# EAGLE design MIDI Output (EAGLE 9.0.1)
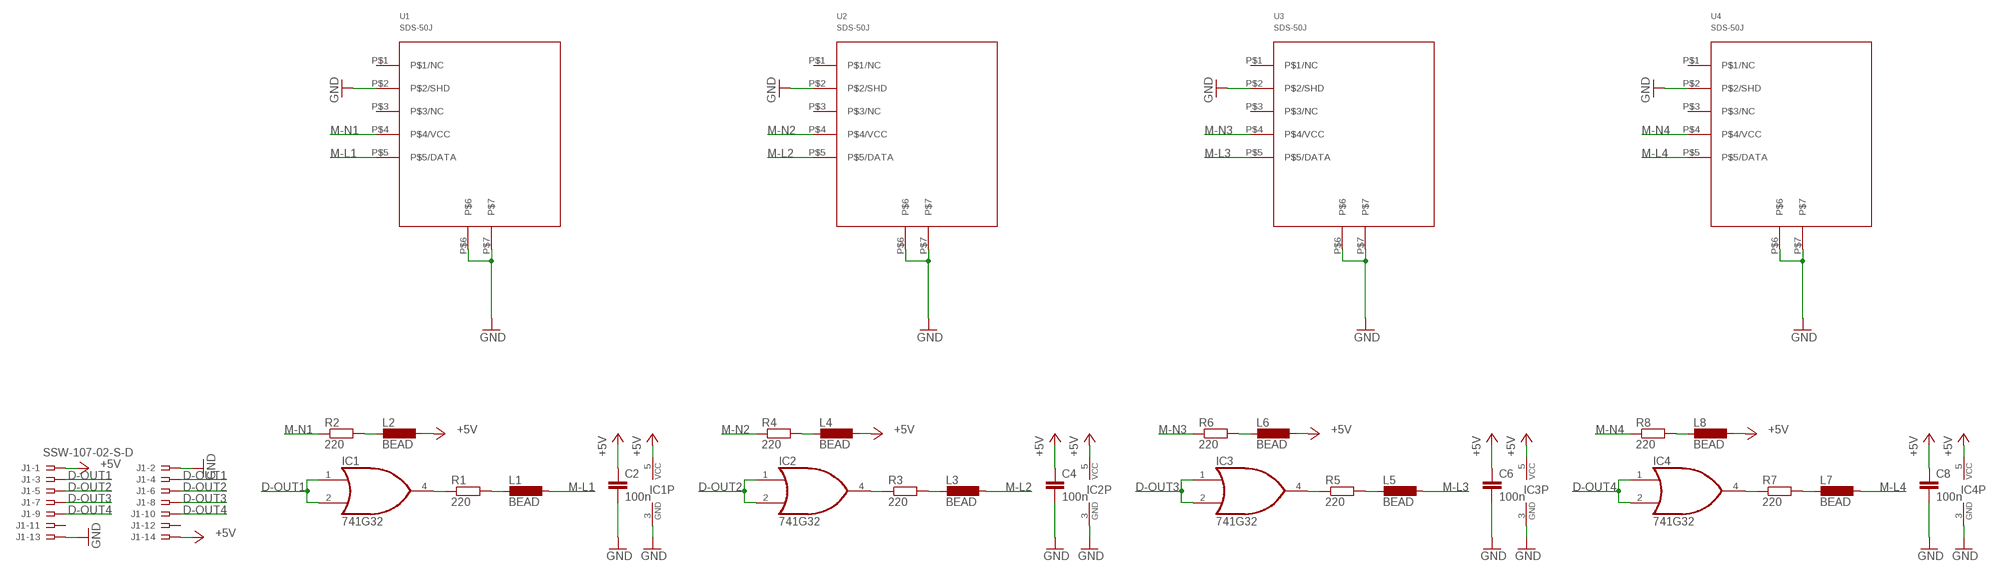
[diagram p0: schematic, sheet 1]

## Parts
C2  100n  C-EUC0805  [C0805]
C4  100n  C-EUC0805  [C0805]
C6  100n  C-EUC0805  [C0805]
C8  100n  C-EUC0805  [C0805]
IC1  741G32  [SOT25]
IC2  741G32  [SOT25]
IC3  741G32  [SOT25]
IC4  741G32  [SOT25]
J1  SSW-107-02-S-D  [SSW-107-02-S-D]
L1  BEAD  [L0805]
L2  BEAD  [L0805]
L3  BEAD  [L0805]
L4  BEAD  [L0805]
L5  BEAD  [L0805]
L6  BEAD  [L0805]
L7  BEAD  [L0805]
L8  BEAD  [L0805]
R1  220  R-EU_R0805  [R0805]
R2  220  R-EU_R0805  [R0805]
R3  220  R-EU_R0805  [R0805]
R4  220  R-EU_R0805  [R0805]
R5  220  R-EU_R0805  [R0805]
R6  220  R-EU_R0805  [R0805]
R7  220  R-EU_R0805  [R0805]
R8  220  R-EU_R0805  [R0805]
U1  SDS-50J  [SDS-50J]
U2  SDS-50J  [SDS-50J]
U3  SDS-50J  [SDS-50J]
U4  SDS-50J  [SDS-50J]

## Nets
+5V: C2.1 C4.1 C6.1 C8.1 IC1.5(VCC) IC2.5(VCC) IC3.5(VCC) IC4.5(VCC) J1.1 J1.14 L2.2 L4.2 L6.2 L8.2
D-OUT1: IC1.1(I0) IC1.2(I1) J1.3 J1.4
D-OUT2: IC2.1(I0) IC2.2(I1) J1.5 J1.6
D-OUT3: IC3.1(I0) IC3.2(I1) J1.7 J1.8
D-OUT4: IC4.1(I0) IC4.2(I1) J1.9 J1.10
GND: C2.2 C4.2 C6.2 C8.2 IC1.3(GND) IC2.3(GND) IC3.3(GND) IC4.3(GND) J1.2 J1.13 U1.P$2(P$2/SHD) U1.P$6 U1.P$7 U2.P$2(P$2/SHD) U2.P$6 U2.P$7 U3.P$2(P$2/SHD) U3.P$6 U3.P$7 U4.P$2(P$2/SHD) U4.P$6 U4.P$7
M-L1: L1.2 U1.P$5(P$5/DATA)
M-L2: L3.2 U2.P$5(P$5/DATA)
M-L3: L5.2 U3.P$5(P$5/DATA)
M-L4: L7.2 U4.P$5(P$5/DATA)
M-N1: R2.1 U1.P$4(P$4/VCC)
M-N2: R4.1 U2.P$4(P$4/VCC)
M-N3: R6.1 U3.P$4(P$4/VCC)
M-N4: R8.1 U4.P$4(P$4/VCC)
N$4: IC1.4(O) R1.1
N$8: L2.1 R2.2
N$9: L1.1 R1.2
N$12: L3.1 R3.2
N$14: L4.1 R4.2
N$16: IC2.4(O) R3.1
N$20: L5.1 R5.2
N$22: L6.1 R6.2
N$24: IC3.4(O) R5.1
N$28: L7.1 R7.2
N$30: L8.1 R8.2
N$32: IC4.4(O) R7.1
Unconnected: J1.11 J1.12 U1.P$1(P$1/NC) U1.P$3(P$3/NC) U2.P$1(P$1/NC) U2.P$3(P$3/NC) U3.P$1(P$1/NC) U3.P$3(P$3/NC) U4.P$1(P$1/NC) U4.P$3(P$3/NC)

## Library data of the parts
C2 C4 C6 C8 = rcl:C-EU: CAPACITOR, European symbol
IC1-IC4 = MIDI router parts:74*1G32: 2-input OR gate; SPICEPREFIX: J
J1 = con-samtec:SSW-107-02-S-D: THROUGH-HOLE .025" SQ POST SOCKET Source: Samtec SSW.pdf; MPN: SSW-107-02-S-D; OC_FARNELL: unknown; OC_NEWARK: 11P9431
L1-L8 = MIDI router parts:BEAD
R1-R8 = rcl:R-EU_: RESISTOR, European symbol
U1-U4 = MIDI router parts:SDS-50J

## Board
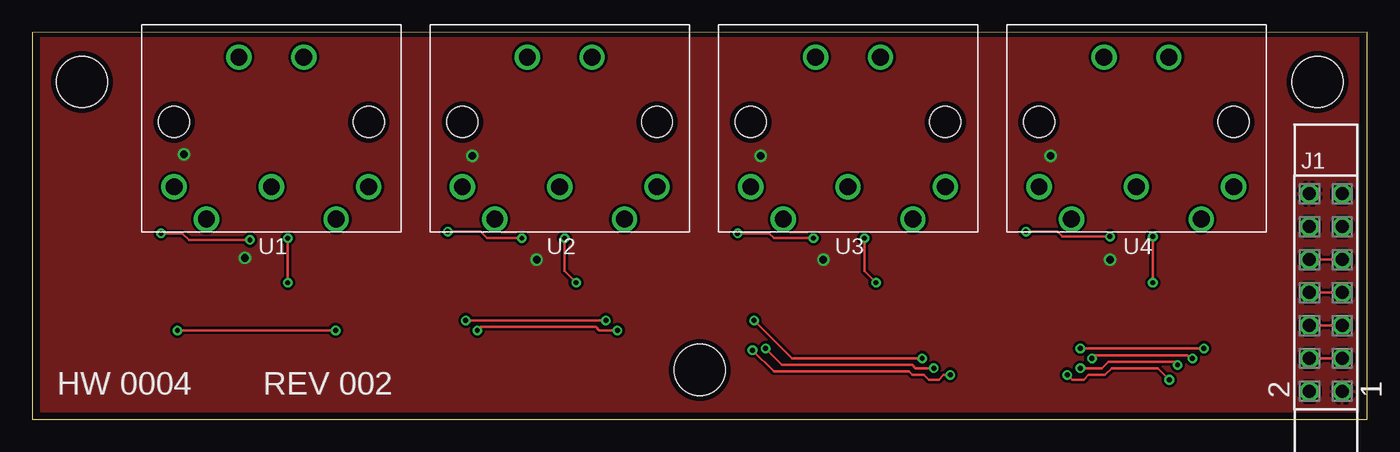
[diagram p1: board, top side]
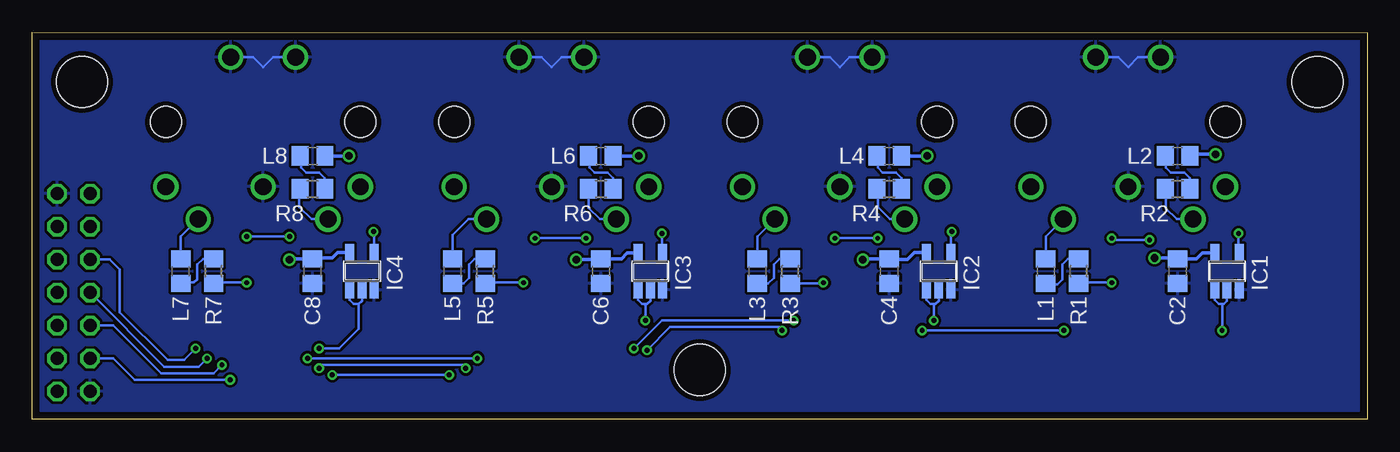
[diagram p2: board, bottom side, seen from below]

Size 102.87 x 29.84 mm. Coordinates in mm from the lower left corner, seen from the top.
Outline: 0,0 102.87,0 102.87,29.84 0,29.84 0,0
Copper layers (1*16): Top 0.0356mm / dielectric 1.5011mm / Bottom 0.0356mm
Design rules "LaenPCBOrder *": minimum track width 6mil, minimum drill 13mil, track to track 8mil, track to pad 8mil, pad to pad 8mil, via to via 8mil, smd to smd 8mil, copper to edge 15mil, drill to drill 6mil, minimum pad ring 7mil, minimum via ring 7mil, stop-mask expansion 3mil, vias tented up to drill 0mil, thermal gap 10mil
Holes 3.96 mm at 3.81,26.04 99.06,26.04 51.44,3.81

### Footprints (pad centres in the part's own frame; a part is rotated, then mirrored left to right if it is on the bottom)
C0805 = smd 1.3 x 1.5: 1 -0.95,0; 2 0.95,0
SOT25 = smd 0.69 x 1.29: 1 -0.95,-1.44; 2 0,-1.44; 3 0.95,-1.44; 4 0.95,1.44; 5 -0.95,1.44
SSW-107-02-G-D = drill 1 pad 1.5 octagon: 1 -7.62,-1.27; 2 -7.62,1.27; 3 -5.08,-1.27; 4 -5.08,1.27; 5 -2.54,-1.27; 6 -2.54,1.27; 7 0,-1.27; 8 0,1.27; 9 2.54,-1.27; 10 2.54,1.27; 11 5.08,-1.27; 12 5.08,1.27; 13 7.62,-1.27; 14 7.62,1.27
L0805 = smd 1.3 x 1.5: 1 -0.95,0; 2 0.95,0
R0805 = smd 1.3 x 1.5: 1 -0.95,0; 2 0.95,0
SDS-50J = drill 1.3: P$1 7.5,10; P$2 0,10; P$3 -7.5,10; P$4 5,12.5; P$5 -5,12.5; P$6 2.5,0; P$7 -2.5,0 | hole 2.4: -7.5,5; 7.5,5

### Placement (x,y rotation side)
C2  14.61,11.43 270 bottom
C4  36.83,11.43 270 bottom
C6  59.05,11.43 270 bottom
C8  81.28,11.43 270 bottom
IC1  10.79,11.43 0 bottom
IC2  33.02,11.43 0 bottom
IC3  55.24,11.43 0 bottom
IC4  77.47,11.43 0 bottom
J1  SSW-107-02-G-D  [SSW-107-02-G-D]  99.69,9.78 90 top
L1  24.77,11.43 90 bottom
L2  14.61,20.32 0 bottom
L3  46.99,11.43 90 bottom
L4  36.83,20.32 0 bottom
L5  70.48,11.43 90 bottom
L6  59.05,20.32 0 bottom
L7  91.44,11.43 90 bottom
L8  81.28,20.32 0 bottom
R1  22.23,11.43 90 bottom
R2  14.61,17.78 0 bottom
R3  44.45,11.43 90 bottom
R4  36.83,17.78 0 bottom
R5  67.94,11.43 90 bottom
R6  59.05,17.78 0 bottom
R7  88.9,11.43 90 bottom
R8  81.28,17.78 0 bottom
U1  18.41,27.94 180 top
U2  40.64,27.94 180 top
U3  62.87,27.94 180 top
U4  85.09,27.94 180 top

### Tracks (layer width: path | path; a pad name or v marks a point on that pad's centre or on a via)
+5V  (via drill 0.58)
  Bottom 0.254: IC1.5 11.79,12.83 12.7,12.83 13.15,12.38 C2.1 14.67,12.45 v16.38,12.45 | L2.2 13.53,20.45 v11.68,20.45 | L4.2 v33.91,20.32 | IC2.5 34.88,12.87 35.43,12.32 36.77,12.32 C4.1 38.8,12.38 v38.86,12.32 | L6.2 v56.13,20.32 | IC3.5 56.24,12.83 57.02,12.83 57.47,12.38 C6.1 59.12,12.32 v60.96,12.32 | L8.2 v78.49,20.32 | IC4.5 79.33,12.87 79.76,12.45 81.21,12.45 C8.1 83,12.38 v83.06,12.32
  pour Top: 0.64,29.84 0.64,0.64 102.23,0.64 102.23,29.84
D-OUT1  (via drill 0.38)
  Top 0.191: J1.4 J1.3 | v87.63,3.05 86.74,3.94 83.19,3.94 82.68,3.43 81.41,3.43 81.03,3.05 80.14,3.05 v79.76,3.43 | v70.74,3.43 70.23,3.43 69.85,3.05 69.09,3.05 68.71,3.43 67.82,3.43 67.56,3.68 57.15,3.68 v55.5,5.33 | v45.09,6.86 43.69,6.86 43.43,7.11 34.54,7.11 v34.29,6.86 | v23.37,6.86 v11.18,6.86
  Bottom 0.191: IC1.2 10.79,9.14 11.05,8.89 11.18,8.89 | 11.18,8.89 11.43,8.89 11.74,9.21 IC1.1 | v79.76,3.43 v70.74,3.43 | v55.5,5.33 53.72,7.11 45.34,7.11 v45.09,6.86 | v34.29,6.86 v23.37,6.86 | v11.18,6.86 11.18,8.89 | J1.4 96.65,4.7 95,3.05 v87.63,3.05
D-OUT2  (via drill 0.38)
  Top 0.191: J1.6 J1.5 | v88.27,4.19 88.01,4.45 82.93,4.45 82.42,3.94 v80.77,3.94 | v69.47,3.94 68.07,3.94 67.82,4.19 57.78,4.19 v56.52,5.46 | v44.2,7.62 v33.4,7.62
  Bottom 0.191: IC2.2 33.02,9.14 33.27,8.89 33.4,8.89 | 33.4,8.89 33.66,8.89 33.97,9.21 IC2.1 | v88.27,4.19 88.9,3.56 92.96,3.56 96.65,7.24 J1.6 | v80.77,3.94 80.52,4.19 69.72,4.19 v69.47,3.94 | v56.52,5.46 54.36,7.62 v44.2,7.62 | v33.4,7.62 33.4,8.89
D-OUT3  (via drill 0.38)
  Top 0.191: J1.8 J1.7 | v89.41,4.7 89.28,4.7 89.03,4.95 81.92,4.95 v81.66,4.7 | v68.58,4.7 58.55,4.7 v55.63,7.62
  Bottom 0.191: IC3.2 55.24,9.14 55.5,8.89 55.75,8.89 | 55.75,8.89 55.88,8.89 56.2,9.21 IC3.1 | v89.41,4.7 90.04,4.06 92.71,4.06 J1.8 | v81.66,4.7 v68.58,4.7 | v55.63,7.62 55.63,8.76 55.75,8.89
D-OUT4  (via drill 0.38)
  Top 0.191: J1.10 J1.9 | v90.3,5.46 v80.77,5.46
  Bottom 0.191: IC4.2 77.47,9.14 77.72,8.89 | 77.72,8.89 78.11,8.89 78.42,9.21 IC4.1 | v90.3,5.46 91.19,4.57 92.46,4.57 96.14,8.26 96.14,11.56 96.9,12.32 J1.10 | v80.77,5.46 79.25,5.46 77.72,6.99 77.72,8.89
GND
  Bottom 0.191: U4.P$6 84.33,27.94 85.09,27.18 85.85,27.94 U4.P$7 | U3.P$6 62.1,27.94 62.87,27.18 63.63,27.94 U3.P$7 | U2.P$6 39.88,27.94 40.64,27.18 41.4,27.94 U2.P$7 | U1.P$6 17.65,27.94 18.41,27.18 19.18,27.94 U1.P$7
  pour Bottom: 0.64,29.21 0.64,0.64 102.23,0.64 102.23,29.21
M-L1
  Bottom 0.191: L1.2 24.77,14.09 U1.P$5
M-L2
  Bottom 0.191: U2.P$5 46.99,14.1 L3.2
M-L3
  Bottom 0.191: L5.2 70.48,14.22 69.27,15.44 U3.P$5
M-L4
  Bottom 0.191: L7.2 91.44,14.09 U4.P$5
M-N1
  Bottom 0.191: U1.P$4 14.68,15.44 15.49,16.26 15.49,17.72 R2.1
M-N2
  Bottom 0.191: U2.P$4 36.78,15.44 37.72,16.38 37.72,17.72 R4.1
M-N3
  Bottom 0.191: U3.P$4 59.13,15.44 60.01,16.32 R6.1
M-N4
  Bottom 0.191: U4.P$4 81.35,15.44 82.3,16.38 82.3,17.71 R8.1
N$4  (via drill 0.38)
  Top 0.191: v9.91,14.35 11.56,14.35 12.06,13.84 v16.76,13.84 | v19.68,13.97 v19.68,10.54
  Bottom 0.191: IC1.4 9.91,12.93 v9.91,14.35 | R1.1 22.16,10.54 v19.68,10.54 | v16.76,13.84 19.56,13.84 v19.68,13.97
N$8
  Bottom 0.191: R2.2 13.65,18.61 14.1,19.05 15.11,19.05 15.49,19.43 15.49,20.26 L2.1
N$9
  Bottom 0.191: R1.2 23.05,12.38 23.5,11.94 23.5,10.79 23.88,10.41 24.7,10.41 L1.1
N$12
  Bottom 0.191: R3.2 45.28,12.38 45.72,11.94 45.72,10.92 46.16,10.48 L3.1
N$14
  Bottom 0.191: R4.2 35.88,18.61 36.32,19.05 37.34,19.05 37.72,19.43 37.72,20.26 L4.1
N$16  (via drill 0.38)
  Top 0.191: v32,14.48 34.54,14.48 35.05,13.97 v37.72,13.97 | v41.02,13.97 41.02,11.43 v41.91,10.54
  Bottom 0.191: IC2.4 32.07,14.41 v32,14.48 | v37.72,13.97 v41.02,13.97 | v41.91,10.54 41.97,10.48 R3.1
N$20
  Bottom 0.191: R5.2 68.77,12.38 69.22,11.94 69.22,10.92 69.66,10.48 L5.1
N$22
  Bottom 0.191: R6.2 58.1,18.61 58.55,19.05 59.56,19.05 59.94,19.43 59.94,20.26 L6.1
N$24  (via drill 0.38)
  Top 0.191: v54.36,14.35 56.77,14.35 57.15,13.97 v60.2,13.97 | v64.14,13.97 64.14,11.43 v65.02,10.54
  Bottom 0.191: IC3.4 54.36,12.93 v54.36,14.35 | v60.2,13.97 v64.14,13.97 | R5.1 67.88,10.54 v65.02,10.54
N$28
  Bottom 0.191: R7.2 89.73,12.38 90.17,11.94 90.17,10.79 90.42,10.54 91.38,10.54 L7.1
N$30
  Bottom 0.191: R8.2 80.33,18.61 80.77,19.05 81.79,19.05 82.17,19.43 82.17,20.26 L8.1
N$32  (via drill 0.38)
  Top 0.191: v76.58,14.48 78.99,14.48 79.38,14.1 v83.06,14.1 | v86.36,14.1 v86.36,10.54
  Bottom 0.191: IC4.4 76.52,14.42 v76.58,14.48 | v86.36,10.54 88.84,10.54 R7.1 | v83.06,14.1 v86.36,14.1

### Text on the board
tNames: HW 0004 | REV 002